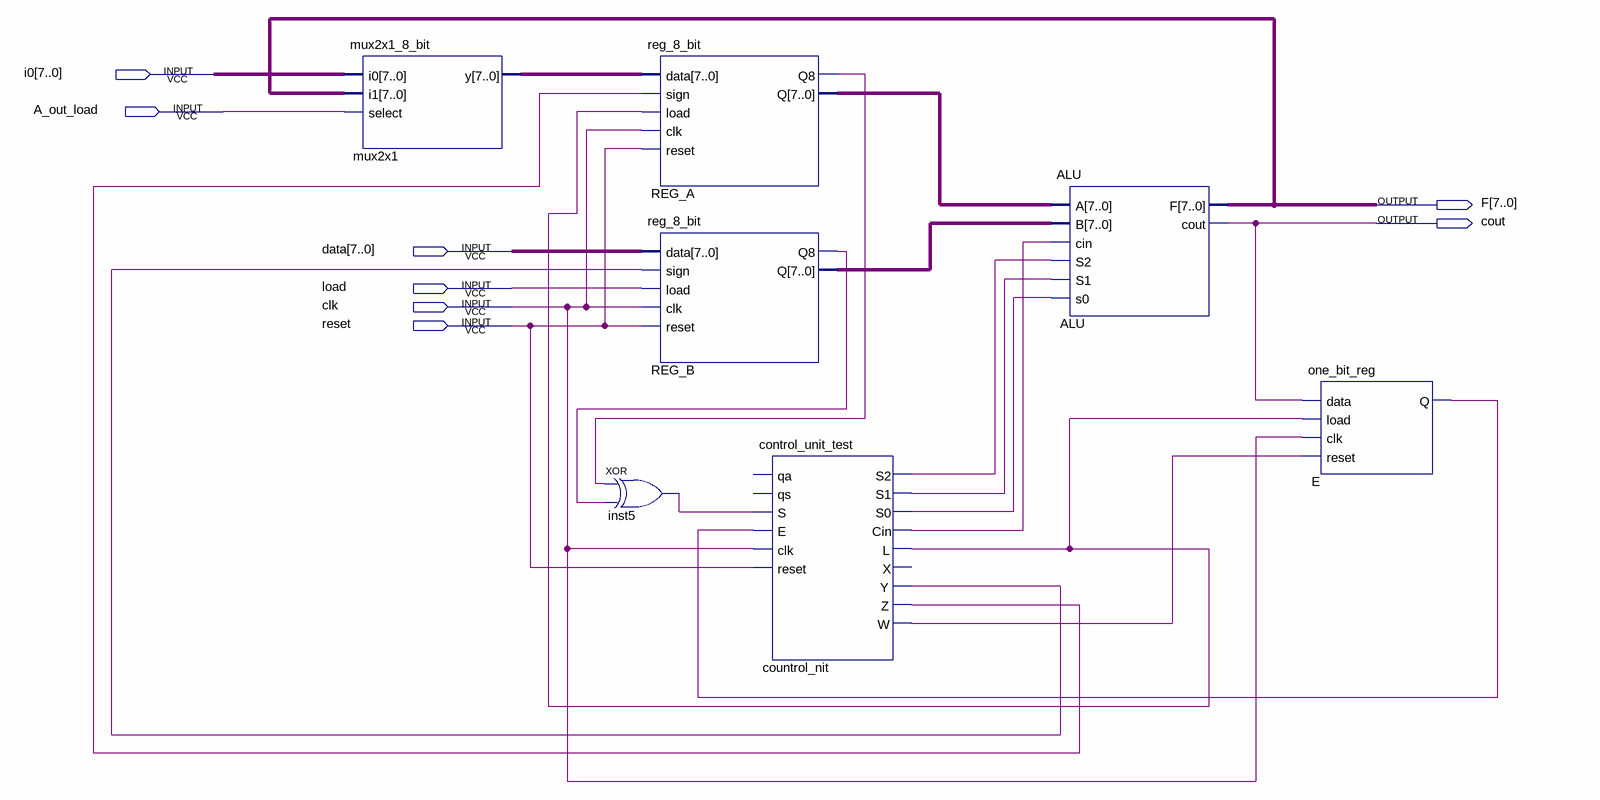
[diagram p0: schematic sheet]
// Quartus schematic orga_assgiment_Q2_v1.bdf as structural Verilog: 7 symbols, 8 pins
module orga_assgiment_Q2_v1 (
  input  [7:0] i0,
  input  A_out_load,
  input  [7:0] data,
  input  load,
  input  clk,
  input  reset,
  output [7:0] F,
  output cout
);

  wire countrol_nit_cin, countrol_nit_l, countrol_nit_s0, countrol_nit_s1, countrol_nit_s2, countrol_nit_w,
       countrol_nit_y, countrol_nit_z, E_q, inst5_out, REG_A_q8, REG_B_q8;
  wire [7:0] mux2x1_y, REG_A_q, REG_B_q;

  mux2x1_8_bit mux2x1 (.i0(i0), .i1(F), .select(A_out_load), .y(mux2x1_y));
  xor inst5 (inst5_out, REG_A_q8, REG_B_q8);
  reg_8_bit REG_A (
    .data(mux2x1_y), .sign(countrol_nit_z), .load(countrol_nit_l), .clk(clk), .reset(reset), .Q8(REG_A_q8),
    .Q(REG_A_q));
  reg_8_bit REG_B (
    .data(data), .sign(countrol_nit_y), .load(load), .clk(clk), .reset(reset), .Q8(REG_B_q8), .Q(REG_B_q));
  control_unit_test countrol_nit (
    .S(inst5_out), .E(E_q), .clk(clk), .reset(reset), .S2(countrol_nit_s2), .S1(countrol_nit_s1),
    .S0(countrol_nit_s0), .Cin(countrol_nit_cin), .L(countrol_nit_l), .Y(countrol_nit_y), .Z(countrol_nit_z),
    .W(countrol_nit_w));  // open: qa, qs, X
  ALU ALU (
    .A(REG_A_q), .B(REG_B_q), .cin(countrol_nit_cin), .S2(countrol_nit_s2), .S1(countrol_nit_s1),
    .s0(countrol_nit_s0), .F(F), .cout(cout));
  one_bit_reg E (.data(cout), .load(countrol_nit_l), .clk(clk), .reset(countrol_nit_w), .Q(E_q));
endmodule
